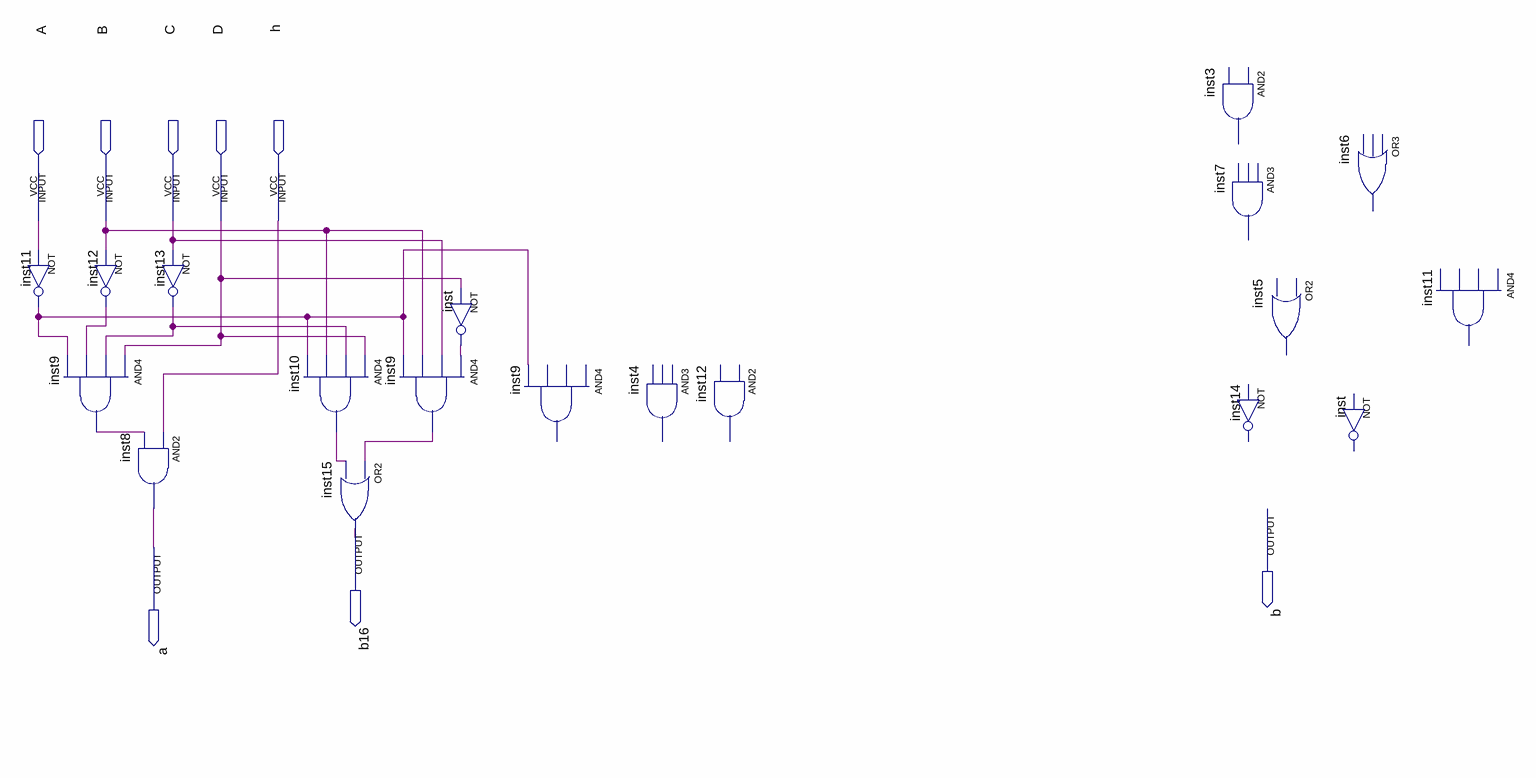
[diagram p0: schematic sheet]
// Quartus schematic Block1.bdf as structural Verilog: 19 symbols, 8 pins
module Block1 (
  inout  A,
  inout  B,
  input  C,
  input  D,
  input  h,
  output b16
);

  wire inst9_out, inst9_out_2, inst10_out, inst11_out, inst12_out, inst13_out, inst_out;

  not inst11 (inst11_out, A);
  and inst9 (inst9_out_2, D, inst13_out, inst12_out, inst11_out);
  not inst12 (inst12_out, B);
  and inst8 (A, h, inst9_out_2);
  not inst13 (inst13_out, C);
  and inst10 (inst10_out, D, inst13_out, B, inst11_out);
  or inst15 (b16, inst9_out, inst10_out);
  and inst9_dup2 (inst9_out, inst_out, C, B, inst11_out);
  not inst (inst_out, D);
  // AND4 inst9 has open pins: IN1=open, IN2=open, IN3=open, IN4=inst11_out, OUT=open
  // AND3 inst4 is placed but not wired
  // AND2 inst12 is placed but not wired
  // AND2 inst3 is placed but not wired
  // AND3 inst7 is placed but not wired
  // OR2 inst5 is placed but not wired
  // NOT inst14 is placed but not wired
  // OR3 inst6 is placed but not wired
  // NOT inst is placed but not wired
  // AND4 inst11 is placed but not wired
endmodule
